# Altium schematic sheet POWER_B1.SchDoc
size A3
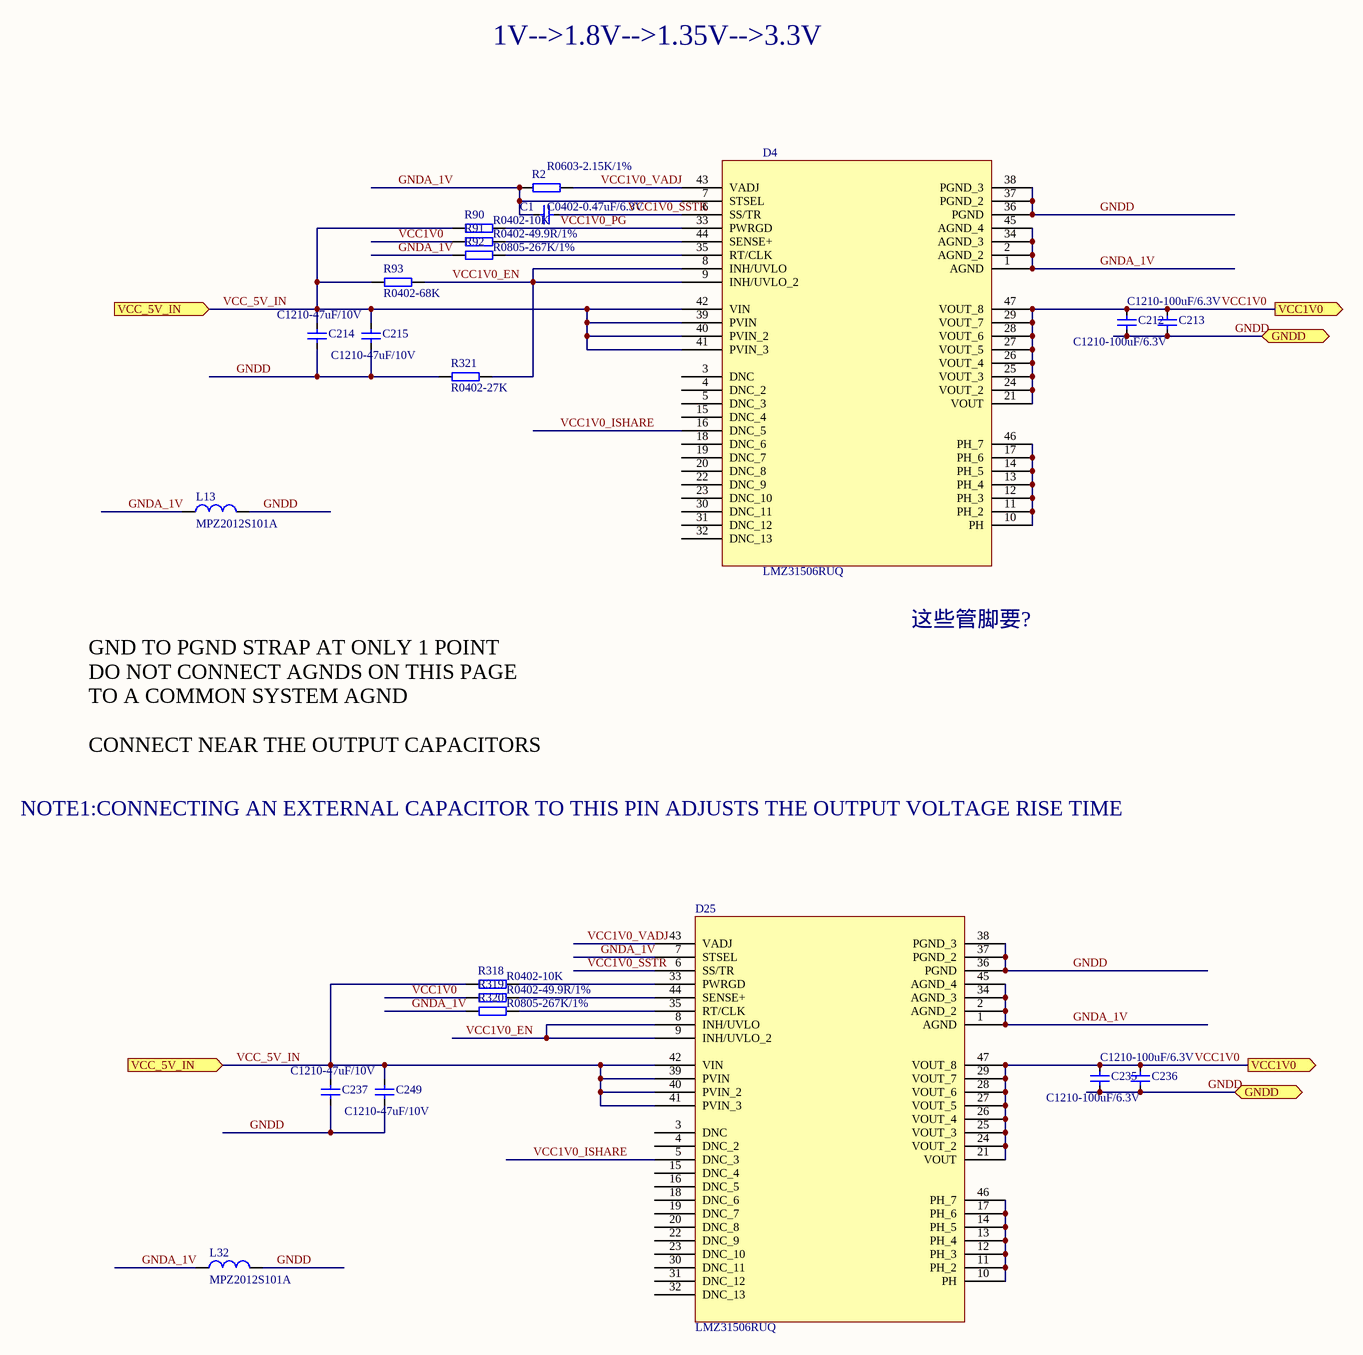
[diagram p0: POWER_B1.SchDoc]

## Parts
C1  C0402-0.47uF/6.3V  [C0402]
C212  C1210-100uF/6.3V  [C1210]
C213  C1210-100uF/6.3V  [C1210]
C214  C1210-47uF/10V  [C1210]
C215  C1210-47uF/10V  [C1210]
C235  C1210-100uF/6.3V  [C1210]
C236  C1210-100uF/6.3V  [C1210]
C237  C1210-47uF/10V  [C1210]
C249  C1210-47uF/10V  [C1210]
D4  LMZ31506RUQ  [RUQ_47]
D25  LMZ31506RUQ  [RUQ_47]
L13  MPZ2012S101A  [R0805]
L32  MPZ2012S101A  [R0805]
R2  R0603-2.15K/1%  [R0603]
R90  R0402-10K  [R0402]
R91  R0402-49.9R/1%  [R0402]
R92  R0805-267K/1%  [R0805]
R93  R0402-68K  [R0402]
R318  R0402-10K  [R0402]
R319  R0402-49.9R/1%  [R0402]
R320  R0805-267K/1%  [R0805]
R321  R0402-27K  [R0402]

## Ports
GNDD, VCC1V0 (out), VCC_5V_IN (in)

## Nets
GNDA_1V: C1.1 D4.1(AGND) D4.2(AGND_2) D4.7(STSEL) D4.34(AGND_3) D4.45(AGND_4) D25.1(AGND) D25.2(AGND_2) D25.7(STSEL) D25.34(AGND_3) D25.45(AGND_4) L13.1 L32.1 R2.1 R92.1 R320.1
GNDD: C212.2 C213.2 C214.2 C215.2 C235.2 C236.2 C237.2 C249.2 D4.36(PGND) D4.37(PGND_2) D4.38(PGND_3) D25.36(PGND) D25.37(PGND_2) D25.38(PGND_3) L13.2 L32.2 R321.1 ; port GNDD
VCC1V0: C212.1 C213.1 C235.1 C236.1 D4.21(VOUT) D4.24(VOUT_2) D4.25(VOUT_3) D4.26(VOUT_4) D4.27(VOUT_5) D4.28(VOUT_6) D4.29(VOUT_7) D4.47(VOUT_8) D25.21(VOUT) D25.24(VOUT_2) D25.25(VOUT_3) D25.26(VOUT_4) D25.27(VOUT_5) D25.28(VOUT_6) D25.29(VOUT_7) D25.47(VOUT_8) R91.1 R319.1 ; port VCC1V0
VCC1V0_EN: D4.8(INH/UVLO) D4.9(INH/UVLO_2) D25.8(INH/UVLO) D25.9(INH/UVLO_2) R93.2 R321.2
VCC1V0_ISHARE: D4.16(DNC_5) D25.5(DNC_3)
VCC1V0_PG: D4.33(PWRGD) R90.2
VCC1V0_SSTR: C1.2 D4.6(SS/TR) D25.6(SS/TR)
VCC1V0_VADJ: D4.43(VADJ) D25.43(VADJ) R2.2
VCC_5V_IN: C214.1 C215.1 C237.1 C249.1 D4.39(PVIN) D4.40(PVIN_2) D4.41(PVIN_3) D4.42(VIN) D25.39(PVIN) D25.40(PVIN_2) D25.41(PVIN_3) D25.42(VIN) R90.1 R93.1 R318.1 ; port VCC_5V_IN
NetD4_10: D4.10(PH) D4.11(PH_2) D4.12(PH_3) D4.13(PH_4) D4.14(PH_5) D4.17(PH_6) D4.46(PH_7)
NetD4_35: D4.35(RT/CLK) R92.2
NetD4_44: D4.44(SENSE+) R91.2
NetD25_10: D25.10(PH) D25.11(PH_2) D25.12(PH_3) D25.13(PH_4) D25.14(PH_5) D25.17(PH_6) D25.46(PH_7)
NetD25_33: D25.33(PWRGD) R318.2
NetD25_35: D25.35(RT/CLK) R320.2
NetD25_44: D25.44(SENSE+) R319.2

Not connected (* = marked no-connect by the designer): D4 3(DNC) 4(DNC_2) 5(DNC_3) 15(DNC_4) 18(DNC_6) 19(DNC_7) 20(DNC_8) 22(DNC_9) 23(DNC_10) 30(DNC_11) 31(DNC_12) 32(DNC_13); D25 3(DNC) 4(DNC_2) 15(DNC_4) 16(DNC_5) 18(DNC_6) 19(DNC_7) 20(DNC_8) 22(DNC_9) 23(DNC_10) 30(DNC_11) 31(DNC_12) 32(DNC_13)

## Notes on the sheet
- 1V-->1.8V-->1.35V-->3.3V
- 这些管脚要?
- NOTE1:CONNECTING AN EXTERNAL CAPACITOR TO THIS PIN ADJUSTS THE OUTPUT VOLTAGE RISE TIME
- GND TO PGND STRAP AT ONLY 1 POINT
  DO NOT CONNECT AGNDS ON THIS PAGE
  TO A COMMON SYSTEM AGND
  CONNECT NEAR THE OUTPUT CAPACITORS

## Library data of the parts
C1 = C0402-0.1uF/16V: X7R; Manufacturer: SAMSUNG; Manufacturer_p/n: CL05X7R104KO5NNN; Part_number: C0402-0.47uF/6.3V; Part_type: CAP; Value: C0402-0.47uF; temperature: -55℃\+125℃; Schematic_Part: CAP; PCB_Footprint: C0402; datasheet: #DataSheet\C_Samsung_General Capacitors.pdf#
C212-C215 C235-C237 C249 = C1210-22uF/16V: Part_type: CAP; Schematic_Part: CAP; PCB_Footprint: C1210
  C212 C213 C235 C236: Part_number: C1210-100uF/6.3V; Value: C1210-100uF/6.3V
  C214 C215 C237 C249: Part_number: C1210-47uF/10V; Value: C1210-47uF/10V
D4 D25 = LMZ31506H_RUQ_47: Part_number: LMZ31506RUQ
L13 L32 = FB0805-330R@100MHz: Manufacturer: TDK; Part_number: MPZ2012S101A; Part_type: BEAD; temperature: -55℃\+125℃; Value1: 330R@100MHz; Schematic_Part: BEAD; PCB_Footprint: R0805; Manufacturer_p/n: MPZ2012S101A
R2 = R0603-0R: Manufacturer: HKT; Manufacturer_p/n: RI0603L000JT; Part_number: R0603-2.15K/1%; Part_type: RES; Value: R0603-2.15K/1%; Schematic_Part: RES; PCB_Footprint: R0603; Manufacturer_p/n2: SAMSUNG
R90 R93 R318 R321 = R0402-10K: Manufacturer: SAMSUNG; Part_type: RES; Value: R0402-10K; Schematic_Part: RES; PCB_Footprint: R0402
  R90 R318: Part_number: R0402-10K
  R93: Part_number: R0402-68K
  R321: Part_number: R0402-27K
R91 R319 = R0402-49.9R/1%: Manufacturer: SUPEROHM; Manufacturer_p/n: RR10050402L49R9FT; Part_number: R0402-49.9R/1%; Part_type: RES; Value: R0402-49.9R/1%; Schematic_Part: RES; PCB_Footprint: R0402
R92 R320 = R0805-267K/1%: Manufacturer: SAMSUNG; Part_number: R0805-267K/1%; Part_type: RES; Value: R0805-267K/1%; Schematic_Part: RES; PCB_Footprint: R0805